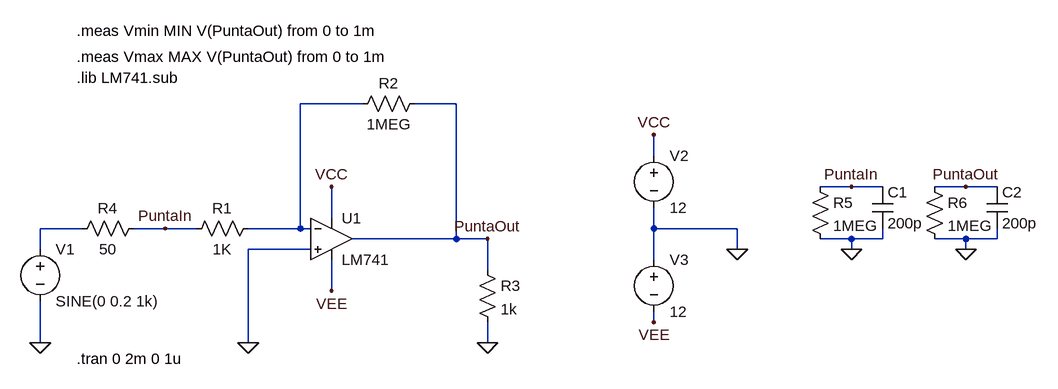
[diagram p0: schematic A1C.asc]
A1C.asc, the LTspice schematic file:
Version 4
SHEET 1 1224 680
WIRE 176 16 80 16
WIRE 320 16 256 16
WIRE 624 96 624 64
WIRE 928 144 880 144
WIRE 976 144 928 144
WIRE 1104 144 1056 144
WIRE 1152 144 1104 144
WIRE 128 192 128 144
WIRE -256 208 -320 208
WIRE -128 208 -176 208
WIRE -80 208 -128 208
WIRE 80 208 80 16
WIRE 80 208 0 208
WIRE 96 208 80 208
WIRE 624 208 624 176
WIRE 752 208 624 208
WIRE 320 224 320 16
WIRE 320 224 160 224
WIRE 368 224 320 224
WIRE 928 224 880 224
WIRE 976 224 976 208
WIRE 976 224 928 224
WIRE 1104 224 1056 224
WIRE 1152 224 1152 208
WIRE 1152 224 1104 224
WIRE -320 240 -320 208
WIRE 96 240 0 240
WIRE 752 240 752 208
WIRE 928 240 928 224
WIRE 1104 240 1104 224
WIRE 624 256 624 208
WIRE 368 272 368 224
WIRE 128 304 128 256
WIRE 624 352 624 336
WIRE -320 384 -320 320
WIRE 0 384 0 240
WIRE 368 384 368 352
FLAG 0 384 0
FLAG -320 384 0
FLAG 368 384 0
FLAG 752 240 0
FLAG 624 64 VCC
FLAG 624 352 VEE
FLAG 128 144 VCC
FLAG 128 304 VEE
FLAG 928 240 0
FLAG 1104 240 0
FLAG 928 144 PuntaIn
FLAG 1104 144 PuntaOut
FLAG 368 224 PuntaOut
FLAG -128 208 PuntaIn
SYMBOL Opamps\\opamp2 128 160 R0
SYMATTR InstName U1
SYMATTR Value LM741
SYMBOL res 16 192 R90
WINDOW 0 0 56 VBottom 2
WINDOW 3 32 56 VTop 2
SYMATTR InstName R1
SYMATTR Value 1K
SYMBOL res 272 0 R90
WINDOW 0 0 56 VBottom 2
WINDOW 3 32 56 VTop 2
SYMATTR InstName R2
SYMATTR Value 1MEG
SYMBOL voltage -320 224 R0
WINDOW 123 0 0 Left 2
WINDOW 39 0 0 Left 2
SYMATTR InstName V1
SYMATTR Value SINE(0 0.2 1k)
SYMBOL res 352 256 R0
SYMATTR InstName R3
SYMATTR Value 1k
SYMBOL voltage 624 240 R0
SYMATTR InstName V3
SYMATTR Value 12
SYMBOL voltage 624 80 R0
SYMATTR InstName V2
SYMATTR Value 12
SYMBOL res -160 192 R90
WINDOW 0 0 56 VBottom 2
WINDOW 3 32 56 VTop 2
SYMATTR InstName R4
SYMATTR Value 50
SYMBOL res 864 128 R0
SYMATTR InstName R5
SYMATTR Value 1MEG
SYMBOL cap 960 144 R0
SYMATTR InstName C1
SYMATTR Value 200p
SYMBOL res 1040 128 R0
SYMATTR InstName R6
SYMATTR Value 1MEG
SYMBOL cap 1136 144 R0
SYMATTR InstName C2
SYMATTR Value 200p
TEXT -264 -24 Left 2 !.lib LM741.sub
TEXT -264 408 Left 2 !.tran 0 2m 0 1u
TEXT -264 -56 Left 2 !.meas Vmax MAX V(PuntaOut) from 0 to 1m
TEXT -264 -96 Left 2 !.meas Vmin MIN V(PuntaOut) from 0 to 1m

The netlist it stands for:
* A1C.asc
XU1 0 N001 VCC VEE PuntaOut LM741  ; pins In+ In- V+ V- OUT
R1 N001 PuntaIn 1K
R2 PuntaOut N001 1MEG
V1 N002 0 SINE(0 0.2 1k)
R3 PuntaOut 0 1k
V3 0 VEE 12
V2 VCC 0 12
R4 PuntaIn N002 50
R5 PuntaIn 0 1MEG
C1 PuntaIn 0 200p
R6 PuntaOut 0 1MEG
C2 PuntaOut 0 200p
.lib LM741.sub
.tran 0 2m 0 1u
.meas Vmax MAX V(PuntaOut) from 0 to 1m
.meas Vmin MIN V(PuntaOut) from 0 to 1m
.backanno
.end